# EAGLE design 555-test (EAGLE 9.6.2)
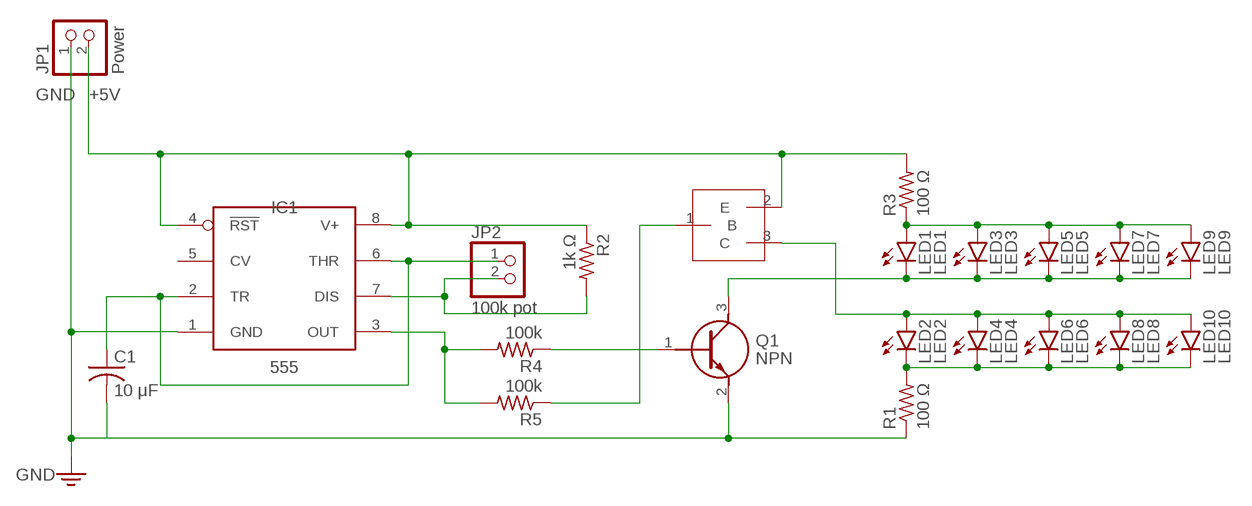
[diagram p0: schematic, sheet 1]

## Parts
C1  10 μF  C-US_CHIP-0805(2012-METRIC)  [CAPC2012X110]
IC1  555  NE555_SOIC  [SOIC127P599X175-8N]
JP1  Power  PINHD-1X2  [1X02]
JP2  100k pot  PINHD-1X2  [1X02]
LED1  LED1  LEDCHIP-LED0805  [CHIP-LED0805]
LED2  LED2  LEDCHIP-LED0805  [CHIP-LED0805]
LED3  LED3  LEDCHIP-LED0805  [CHIP-LED0805]
LED4  LED4  LEDCHIP-LED0805  [CHIP-LED0805]
LED5  LED5  LEDCHIP-LED0805  [CHIP-LED0805]
LED6  LED6  LEDCHIP-LED0805  [CHIP-LED0805]
LED7  LED7  LEDCHIP-LED0805  [CHIP-LED0805]
LED8  LED8  LEDCHIP-LED0805  [CHIP-LED0805]
LED9  LED9  LEDCHIP-LED0805  [CHIP-LED0805]
LED10  LED10  LEDCHIP-LED0805  [CHIP-LED0805]
Q1  NPN  PMBT2222A,215  [PMBT2222A215]
R1  100 Ω  R-US_M0805  [M0805]
R2  1k Ω  R-US_M0805  [M0805]
R3  100 Ω  R-US_M0805  [M0805]
R4  100k  R-US_M0805  [M0805]
R5  100k  R-US_M0805  [M0805]
U$1  PNP  2PB709ARL,235  [SOT95P230X110-3N]

## Nets
+5V: IC1.4(!RST) IC1.8(V+) JP1.2 R2.1 R3.2 U$1.2(E)
GND: C1.2 IC1.1(GND) JP1.1 Q1.2(E) R1.1
N$1: C1.1 IC1.2(TR) IC1.6(THR) JP2.1
N$2: IC1.3(OUT) R4.2 R5.2
N$3: Q1.1(B) R4.1
N$4: LED2.C LED4.C LED6.C LED8.C LED10.C R1.2
N$5: IC1.7(DIS) JP2.2 R2.2
N$6: LED1.A LED3.A LED5.A LED7.A LED9.A R3.1
N$7: LED1.C LED3.C LED5.C LED7.C LED9.C Q1.3(C)
N$8: R5.1 U$1.1(B)
N$9: LED2.A LED4.A LED6.A LED8.A LED10.A U$1.3(C)
Unconnected: IC1.5(CV)

## Library data of the parts
C1 = Capacitor:C-US: Capacitor - ANSI; CATEGORY: Capacitor
IC1 = IC_Clock-Timing:*555: TIMER 555 General purpose precision timers NE555 : Texas Datasheet <http://www.ti.com/general/docs/suppproductinfo.tsp?distId=10&gotoUrl=http%3A%2F%2Fwww.ti.com%2Flit%2Fgpn%2Fne555>, Diodes Incorporated Datasheet <https://www.diodes.com/assets/Datasheets/NE555_SA555_NA555.pdf> LM555 Datasheet <http://www.ti.com/general/docs/suppproductinfo.tsp?distId=10&gotoUrl=http%3A%2F%2Fwww.ti.com%2Flit%2Fgpn%2Flm555> LMC555 Datasheet <http://www.ti.com/general/docs/suppproductinfo.tsp?distId=10&gotoUrl=http%3A%2F%2Fwww.ti.com%2Flit%2Fgpn%2Flmc555> ICM7555 : Maxim Integrated Datasheet <https://datasheets.maximintegrated.com/en/ds/ICM7555-ICM7556.pdf>, Renesas Electronics America Inc Datasheet <https://www.renesas.com/en-us/www/doc/datasheet/icm7555-56.pdf>; CATEGORY: IC_Clock-Timing; CURRENT-SUPPLY: 10mA; DESCRIPTION: IC OSC SGL TIMER 100KHZ 8-SOIC; FREQUENCY: 100kHz; MANUFACTURER: Texas Instruments; MPN: NE555D; OPERATING_TEMP: 0°C to 70°C; PART_STATUS: Active; ROHS_COMPLIANT: ROHS3 Compliant; SUB-CATEGORY: Timer
JP1 JP2 = pinhead:PINHD-1X2: PIN HEADER
LED1-LED10 = led:LED: LED OSRAM: - CHIPLED LG R971, LG N971, LY N971, LG Q971, LY Q971, LO R971, LY R971 LH N974, LH R974 LS Q976, LO Q976, LY Q976 LO Q996 - Hyper CHIPLED LW Q18S LB Q993, LB Q99A, LB R99A - SideLED LS A670, LO A670, LY A670, LG A670, LP A670 LB A673, LV A673, LT A673, LW A673 LH A674 LY A675 LS A676, LA A676, LO A676, LY A676, LW A676 LS A679, LY A679, LG A679 - Hyper Micro SIDELED® LS Y876, LA Y876, LO Y876, LY Y876 LT Y87S - SmartLED LW L88C, LW L88S LB L89C, LB L89S, LG L890 LS L89K, LO L89K, LY L89K LS L896, LA L896, LO L896, LY L896 - TOPLED LS T670, LO T670, LY T670, LG T670, LP T670 LSG T670, LSP T670, LSY T670, LOP T670, LYG T670 LG T671, LOG T671, LSG T671 LB T673, LV T673, LT T673, LW T673 LH T674 LS T676, LA T676, LO T676, LY T676, LB T676, LH T676, LSB T676, LW T676 LB T67C, LV T67C, LT T67C, LS T67K, LO T67K, LY T67K, LW E67C LS E67B, LA E67B, LO E67B, LY E67B, LB E67C, LV E67C, LT E67C LW T67C LS T679, LY T679, LG T679 LS T770, LO T770, LY T770, LG T770, LP T770 LB T773, LV T773, LT T773, LW T773 LH T774 LS E675, LA E675, LY E675, LS T675 LS T776, LA T776, LO T776, LY T776, LB T776 LHGB T686 LT T68C, LB T68C - Hyper Mini TOPLED® LB M676 - Mini TOPLED Santana® LG M470 LS M47K, LO M47K, LY M47K Source: http://www.osram.convergy.de LUXEON: - LUMILED® LXK2-PW12-R00, LXK2-PW12-S00, LXK2-PW14-U00, LXK2-PW14-V00 LXK2-PM12-R00, LXK2-PM12-S00, LXK2-PM14-U00 LXK2-PE12-Q00, LXK2-PE12-R00, LXK2-PE12-S00, LXK2-PE14-T00, LXK2-PE14-U00 LXK2-PB12-K00, LXK2-PB12-L00, LXK2-PB12-M00, LXK2-PB14-N00, LXK2-PB14-P00, LXK2-PB14-Q00 LXK2-PR12-L00, LXK2-PR12-M00, LXK2-PR14-Q00, LXK2-PR14-R00 LXK2-PD12-Q00, LXK2-PD12-R00, LXK2-PD12-S00 LXK2-PH12-R00, LXK2-PH12-S00 LXK2-PL12-P00, LXK2-PL12-Q00, LXK2-PL12-R00 Source: www.luxeon.com KINGBRIGHT: KA-3528ASYC Source: www.kingbright.com
Q1 = PMBT2222A_215:PMBT2222A,215: PMBT2222; PMBT2222A - NPN switching transistors Source: Datasheet <https://assets.nexperia.com/documents/data-sheet/PMBT2222A.pdf>; DESCRIPTION: PMBT2222; PMBT2222A - NPN switching transistors; HEIGHT: 1.1mm; MANUFACTURER_NAME: Nexperia; MANUFACTURER_PART_NUMBER: PMBT2222A,215; MOUSER_PART_NUMBER: 771-PMBT2222A-T/R; MOUSER_PRICE-STOCK: https://www.mouser.co.uk/ProductDetail/Nexperia/PMBT2222A215?qs=LOCUfHb8d9u7n2jbGrJFWg%3D%3D
R1-R5 = rcl:R-US_: RESISTOR, American symbol; SPICEPREFIX: R
U$1 = 2PB709ARL,235-SOT23:2PB709ARL,235

## Board
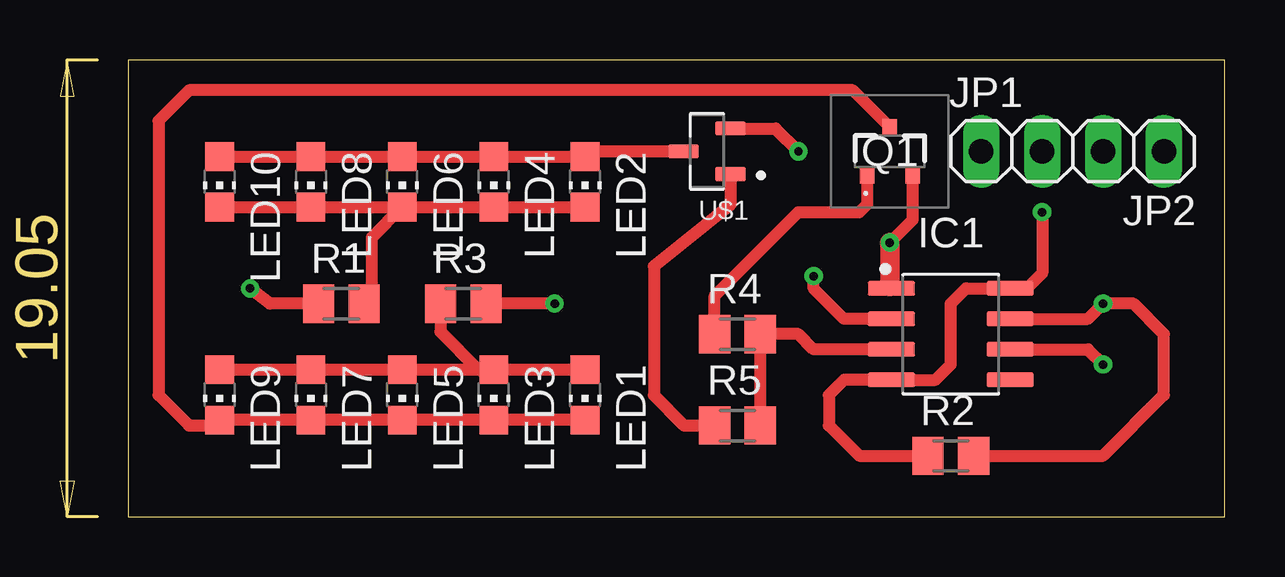
[diagram p1: board, top side]
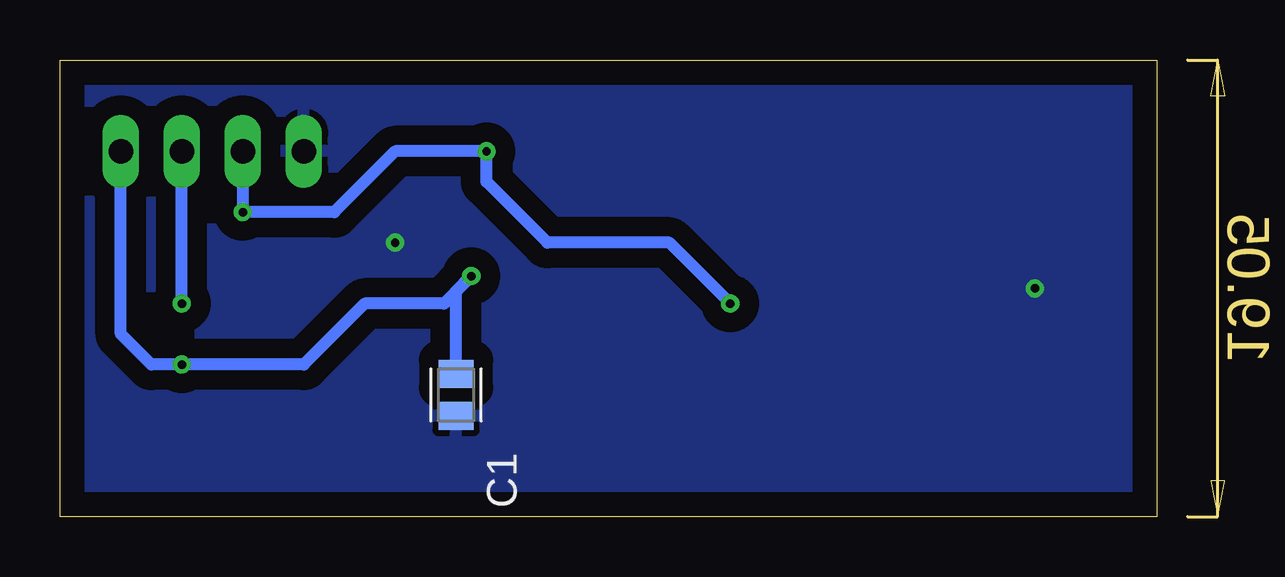
[diagram p2: board, bottom side, seen from below]

Size 45.72 x 19.05 mm. Coordinates in mm from the lower left corner, seen from the top.
Outline: 0,0 45.72,0 45.72,19.05 0,19.05 0,0
Copper layers (1*16): Top 0.035mm / dielectric 1.5mm / Bottom 0.035mm
Design rules "default": minimum track width 6mil, minimum drill 0.35mm, track to track 6mil, track to pad 6mil, pad to pad 6mil, via to via 6mil, smd to smd 6mil, copper to edge 40mil, drill to drill 6mil, minimum pad ring 10mil, minimum via ring 8mil, stop-mask expansion 4mil, vias tented up to drill 0mil, thermal gap 10mil

### Footprints (pad centres in the part's own frame; a part is rotated, then mirrored left to right if it is on the bottom)
CAPC2012X110 = smd 1.165 x 1.465: 1 -0.875,0; 2 0.875,0
SOIC127P599X175-8N = smd 1.965 x 0.602: 1 -2.47,1.905; 2 -2.47,0.635; 3 -2.47,-0.635; 4 -2.47,-1.905; 5 2.47,-1.905; 6 2.47,-0.635; 7 2.47,0.635; 8 2.47,1.905
1X02 = drill 1.016 long: 1 -1.27,0; 2 1.27,0
CHIP-LED0805 = smd 1.2 x 1.2: A 0,-1.05; C 0,1.05
PMBT2222A215 = smd 0.6 x 0.7: 1 -0.95,-1; 2 0.95,-1; 3 0,1
M0805 = smd 1.3 x 1.6: 1 -0.95,0; 2 0.95,0
SOT95P230X110-3N = smd 1.26 x 0.59: 1 -0.98,0.95; 2 -0.98,-0.95; 3 0.98,0

### Placement (x,y rotation side)
C1  29.21,5.08 270 bottom
IC1  34.29,7.62 0 top
JP1  36.83,15.24 0 top
JP2  41.91,15.24 180 top
LED1  19.05,5.08 180 top
LED2  19.05,13.97 180 top
LED3  15.24,5.08 180 top
LED4  15.24,13.97 180 top
LED5  11.43,5.08 180 top
LED6  11.43,13.97 180 top
LED7  7.62,5.08 180 top
LED8  7.62,13.97 180 top
LED9  3.81,5.08 180 top
LED10  3.81,13.97 180 top
Q1  31.75,15.24 0 top
R1  8.89,8.89 0 top
R2  34.29,2.54 0 top
R3  13.97,8.89 0 top
R4  25.4,7.62 0 top
R5  25.4,3.81 0 top
U$1  24.13,15.24 180 top

### Tracks (layer width: path | path; a pad name or v marks a point on that pad's centre or on a via)
+5V  (via drill 0.35)
  Top 0.508: R2.1 30.48,2.54 29.21,3.81 29.21,5.08 29.84,5.71 IC1.4 33.66,5.71 34.29,6.35 34.29,8.89 34.93,9.53 IC1.8 37.47,9.53 38.1,10.16 v38.1,12.7 | v17.78,8.89 R3.2 | U$1.2 26.99,16.19 v27.94,15.24
  Bottom 0.508: JP1.2 v38.1,12.7 34.29,12.7 31.75,15.24 v27.94,15.24 27.94,13.97 25.4,11.43 20.32,11.43 v17.78,8.89
GND  (via drill 0.35)
  Top 0.508: IC1.1 31.75,9.6 | R1.1 5.91,8.89 v5.08,9.53 | Q1.2 32.7,12.38 v31.75,11.43
  Top 0.813: 31.75,9.6 v31.75,11.43
  pour Bottom (isolate 0.813, rank 6): 0,0 0,19.05 45.72,19.05 45.72,0
N$1  (via drill 0.35)
  Top 0.508: IC1.6 40.01,6.99 v40.64,6.35 | IC1.2 29.84,8.26 28.57,9.53 v28.57,10.03
  Bottom 0.508: JP2.1 43.18,7.62 41.91,6.35 v40.64,6.35 35.56,6.35 33.02,8.89 29.72,8.89 v28.57,10.03 29.21,9.4 C1.1
N$2
  Top 0.508: R5.2 R4.2 27.94,7.62 28.57,6.99 IC1.3
N$3
  Top 0.508: R4.1 24.45,9.21 27.94,12.7 30.48,12.7 30.8,13.02 Q1.1
N$4
  Top 0.508: LED10.C LED8.C LED6.C | LED6.C LED4.C LED2.C | R1.2 10.16,9.21 10.16,11.65 LED6.C
N$5  (via drill 0.35)
  Top 0.508: IC1.7 40.01,8.26 v40.64,8.89 41.91,8.89 43.18,7.62 43.18,5.08 40.64,2.54 R2.2
  Bottom 0.508: v40.64,8.89 JP2.2
N$6
  Top 0.508: 12.75,8.62 R3.1 13.02,7.72 14.61,6.13 LED3.A | LED1.A LED3.A | LED3.A LED5.A LED7.A LED9.A
N$7
  Top 0.508: LED1.C LED3.C LED5.C LED7.C LED9.C 3.59,3.81 2.54,3.81 1.27,5.08 1.27,16.51 2.54,17.78 30.21,17.78 Q1.3
N$8
  Top 0.508: U$1.1 25.11,13.02 21.91,10.45 21.91,5.08 23.18,3.81 R5.1
N$9
  Top 0.508: 3.59,15.24 LED10.A LED8.A LED6.A LED4.A LED2.A 19.27,15.24 U$1.3